# EAGLE schematic oscilloscope lcd v1 (EAGLE 9.7.0)
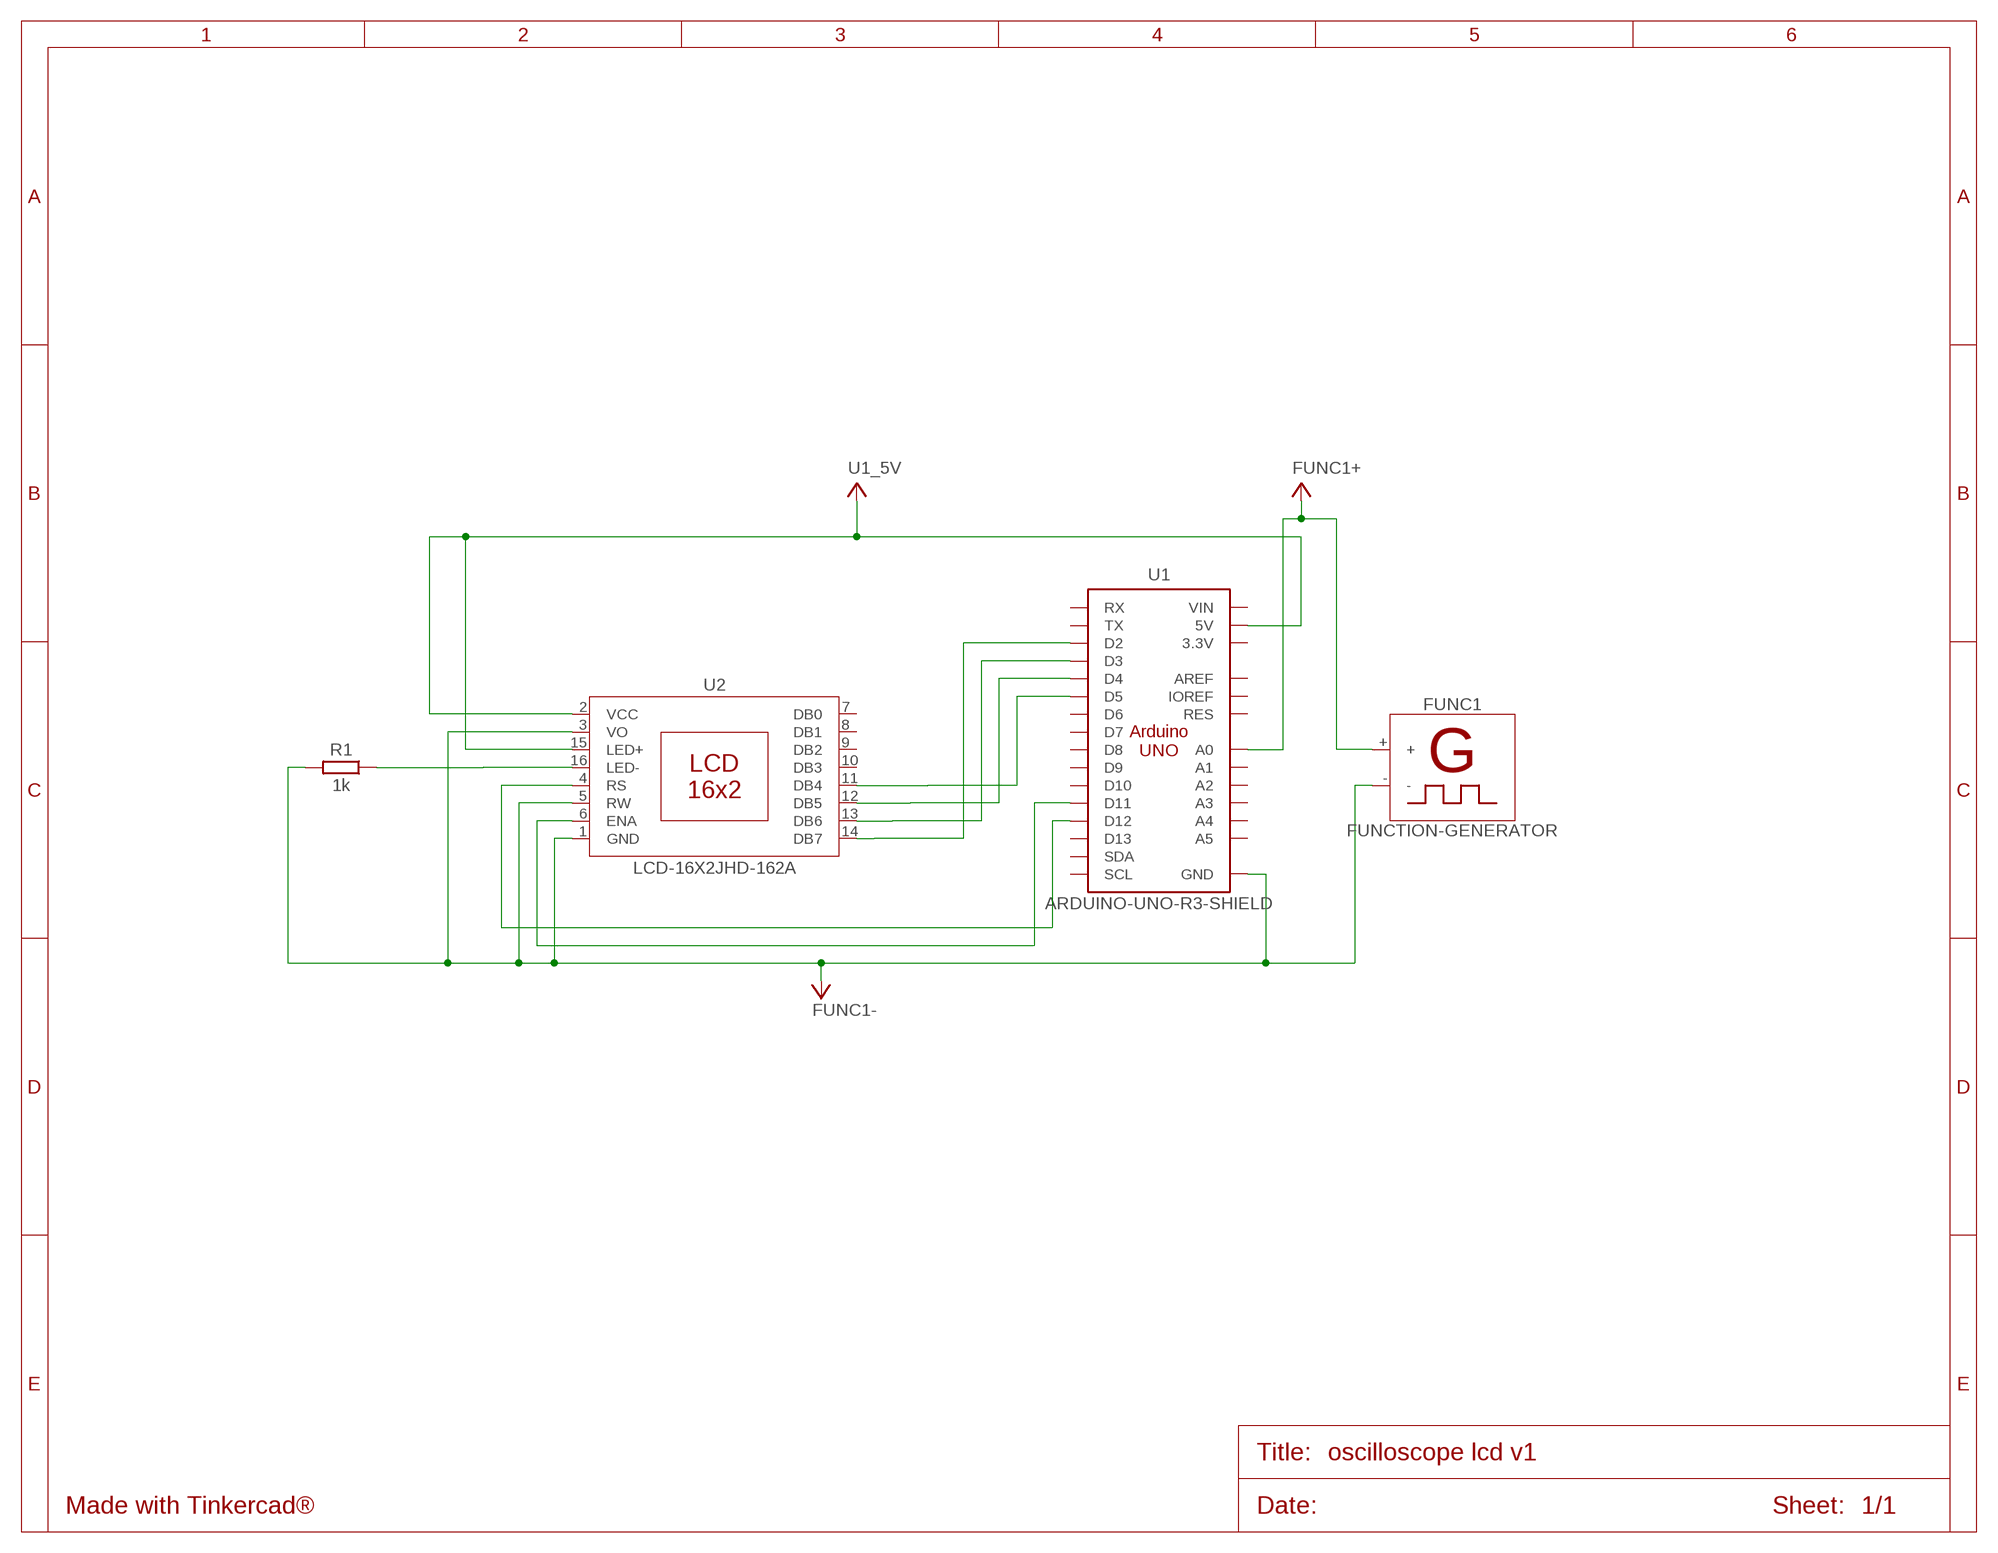
[diagram p0: schematic, sheet 1]

## Parts
FUNC1  FUNCTION-GENERATOR  [BATTERY-GENERIC]
R1  1k  RESISTOR_AXIAL-10.16MM-PITCH  [RESAD1016W63L850D250B]
U1  ARDUINO-UNO-R3-SHIELD  [ARDUINO-UNO-R3-SHIELD]
U2  LCD-16X2JHD-162A  [JHD-162A]

## Nets
FUNC1+: FUNC1.+ U1.A0
FUNC1-: FUNC1.- R1.2 U1.GND@0(GND) U1.GND@1(GND) U1.GND@2(GND) U2.1(GND) U2.3(VO) U2.5(RW)
U1_5V: U1.5V U2.2(VCC) U2.15(LED+)
U1_D2: U1.D2 U2.14(DB7)
U1_D3: U1.D3 U2.13(DB6)
U1_D4: U1.D4 U2.12(DB5)
U1_D5: U1.D5 U2.11(DB4)
U1_D11: U1.D11 U2.6(ENA)
U1_D12: U1.D12 U2.4(RS)
U2_LED-: R1.1 U2.16(LED-)
Unconnected: U1.3.3V U1.A1 U1.A2 U1.A3 U1.A4 U1.A5 U1.AREF U1.D6 U1.D7 U1.D8 U1.D9 U1.D10 U1.D13 U1.IOREF U1.RES U1.RX U1.SCL U1.SDA U1.TX U1.VIN U2.7(DB0) U2.8(DB1) U2.9(DB2) U2.10(DB3)

## Library data of the parts
FUNC1 = Tinkercad:FUNCTION-GENERATOR
R1 = Tinkercad:RESISTOR: Resistor Fixed - Generic
U1 = Tinkercad:ARDUINO-UNO-R3-SHIELD
U2 = Tinkercad:LCD-16X2